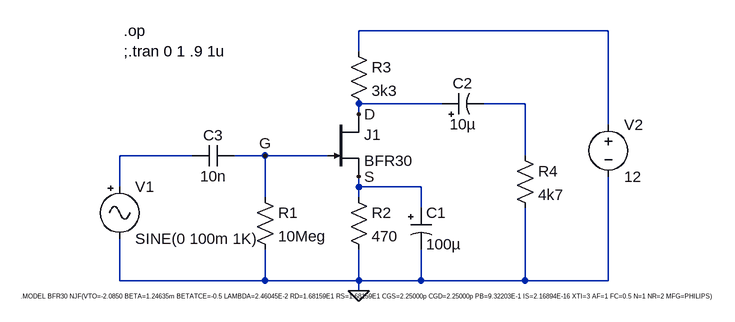
[diagram p0: schematic JFET_EJEMPLO.asc]
JFET_EJEMPLO.asc, the LTspice schematic file:
Version 4
SHEET 1 2812 680
WIRE 560 -16 176 -16
WIRE 176 16 176 -16
WIRE 304 96 176 96
WIRE 432 96 368 96
WIRE 176 112 176 96
WIRE 560 128 560 -16
WIRE -80 176 -192 176
WIRE 32 176 -16 176
WIRE 128 176 32 176
WIRE 432 176 432 96
WIRE -192 224 -192 176
WIRE 176 224 176 208
WIRE 272 224 176 224
WIRE 32 240 32 176
WIRE 176 240 176 224
WIRE 272 256 272 224
WIRE -192 368 -192 304
WIRE 32 368 32 320
WIRE 32 368 -192 368
WIRE 176 368 176 320
WIRE 176 368 32 368
WIRE 272 368 272 320
WIRE 272 368 176 368
WIRE 432 368 432 256
WIRE 432 368 272 368
WIRE 560 368 560 208
WIRE 560 368 432 368
WIRE 176 384 176 368
FLAG 176 384 0
FLAG 176 112 D
FLAG 176 208 S
FLAG 32 176 G
SYMBOL njf 128 112 R0
SYMATTR InstName J1
SYMATTR Value BFR30
SYMBOL res 16 224 R0
SYMATTR InstName R1
SYMATTR Value 10Meg
SYMBOL res 160 224 R0
SYMATTR InstName R2
SYMATTR Value 470
SYMBOL res 160 0 R0
SYMATTR InstName R3
SYMATTR Value 3k3
SYMBOL polcap 256 256 R0
SYMATTR InstName C1
SYMATTR Value 100µ
SYMBOL polcap 304 112 R270
WINDOW 0 32 32 VTop 2
WINDOW 3 0 32 VBottom 2
SYMATTR InstName C2
SYMATTR Value 10µ
SYMBOL cap -16 160 R90
WINDOW 0 0 32 VBottom 2
WINDOW 3 32 32 VTop 2
SYMATTR InstName C3
SYMATTR Value 10n
SYMBOL Misc\\signal -192 208 R0
WINDOW 123 0 0 Left 0
WINDOW 39 0 0 Left 0
SYMATTR InstName V1
SYMATTR Value SINE(0 100m 1K)
SYMBOL voltage 560 112 R0
SYMATTR InstName V2
SYMATTR Value 12
SYMBOL res 416 160 R0
SYMATTR InstName R4
SYMATTR Value 4k7
TEXT -344 392 Left 0 !.MODEL BFR30 NJF(VTO=-2.0850 BETA=1.24635m BETATCE=-0.5 LAMBDA=2.46045E-2 RD=1.68159E1 RS=1.68159E1 CGS=2.25000p CGD=2.25000p PB=9.32203E-1 IS=2.16894E-16 XTI=3 AF=1 FC=0.5 N=1 NR=2 MFG=PHILIPS)
TEXT -186 -16 Left 2 !.op\n;.tran 0 1 .9 1u

The netlist it stands for:
* JFET_EJEMPLO.asc
J1 D G S BFR30
R1 G 0 10Meg
R2 S 0 470
R3 N001 D 3k3
C1 S 0 100µ
C2 D N002 10µ
C3 G N003 10n
V1 N003 0 SINE(0 100m 1K)
V2 N001 0 12
R4 N002 0 4k7
.model NJF NJF
.model PJF PJF
.lib standard.jft
.MODEL BFR30 NJF(VTO=-2.0850 BETA=1.24635m BETATCE=-0.5 LAMBDA=2.46045E-2 RD=1.68159E1 RS=1.68159E1 CGS=2.25000p CGD=2.25000p PB=9.32203E-1 IS=2.16894E-16 XTI=3 AF=1 FC=0.5 N=1 NR=2 MFG=PHILIPS)
.op
;.tran 0 1 .9 1u
.backanno
.end